# EAGLE design tracksoar programmer (EAGLE 7.3.0)
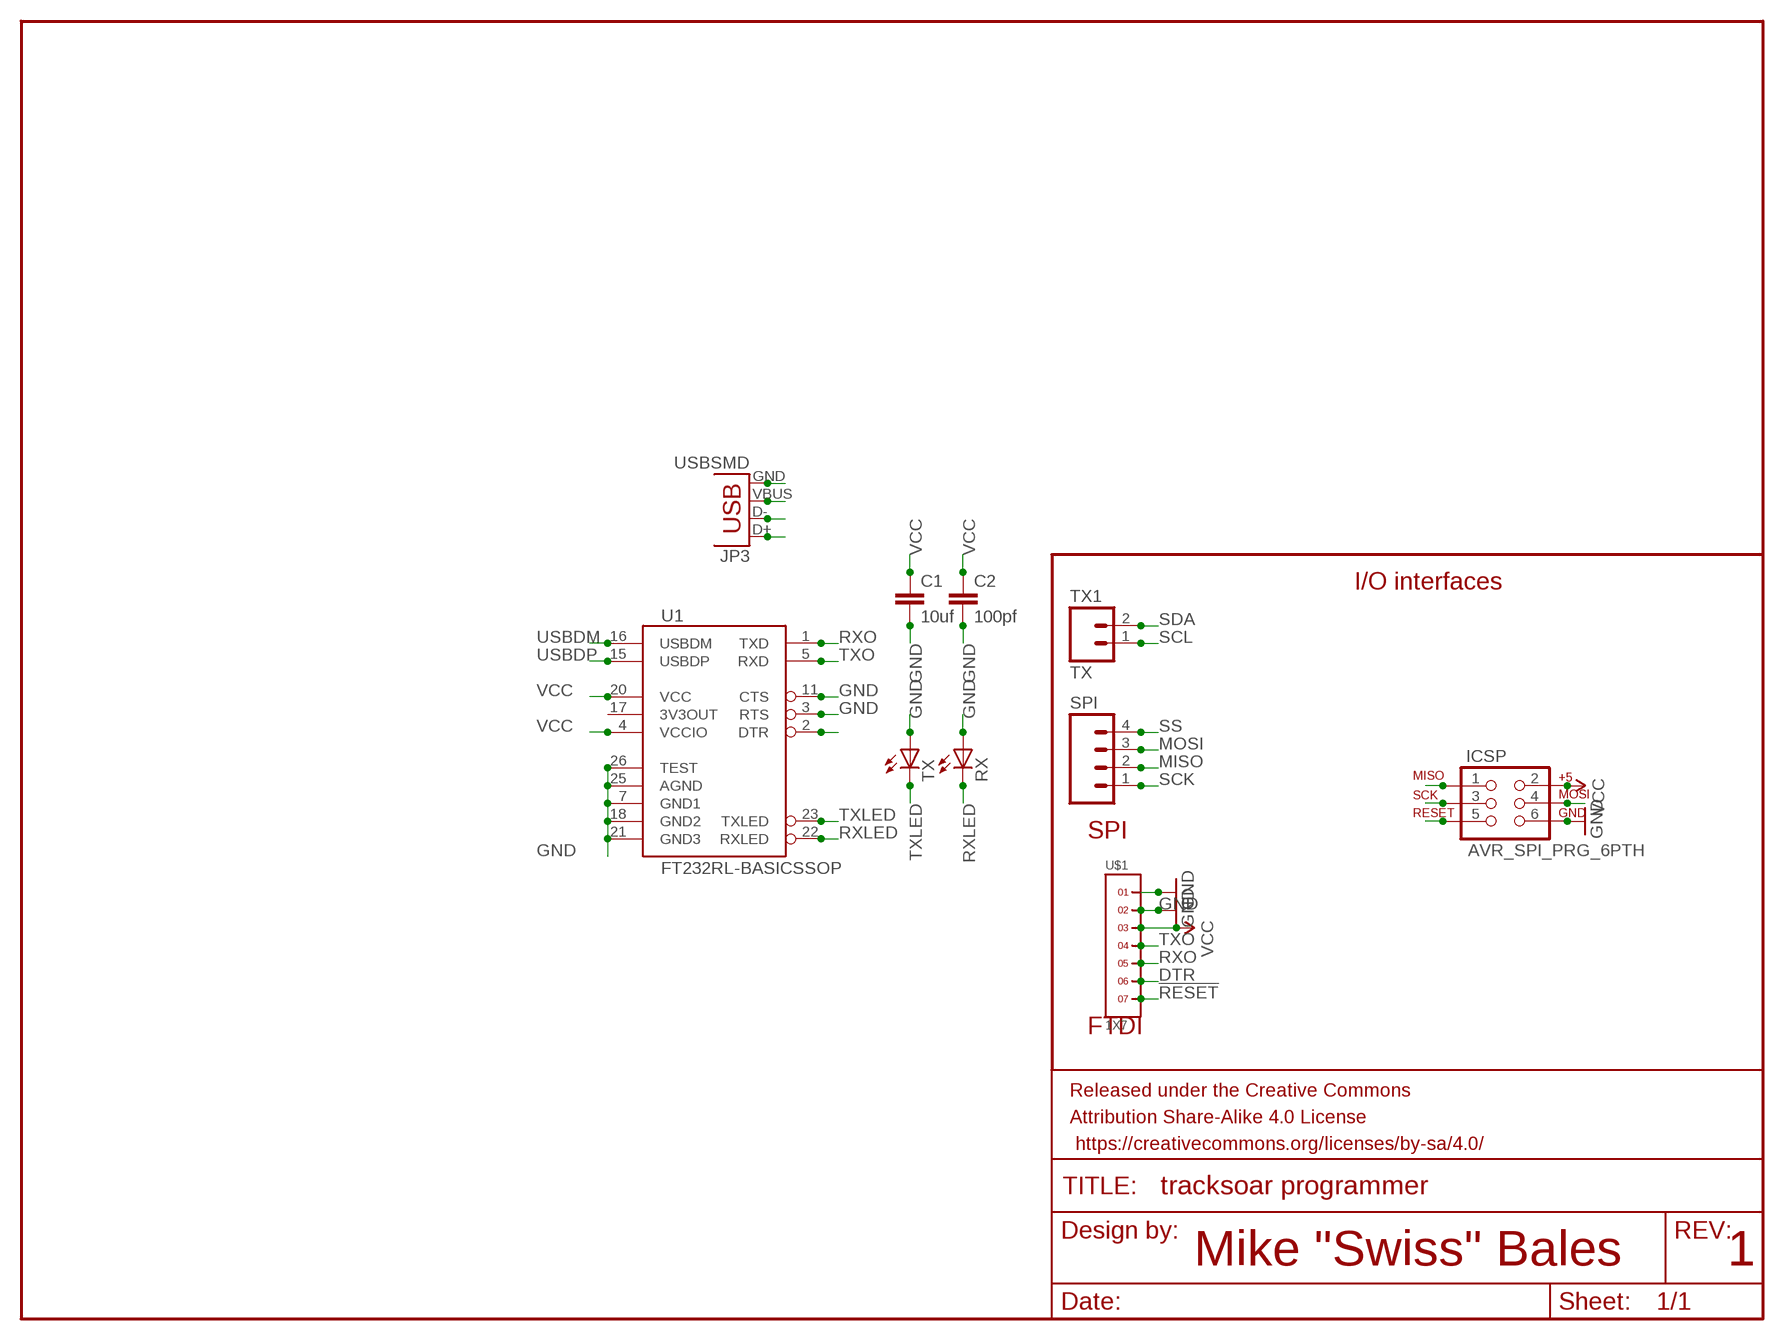
[diagram p0: schematic, sheet 1]

## Parts
C1  10uf  CAP0805  [0805]
C2  100pf  CAP0805  [0805]
FRAME1  FRAME-LETTER  [CREATIVE_COMMONS]
ICSP  AVR_SPI_PRG_6PTH  [2X3]
JP3  USBSMD  [USB-MINIB]
RX  LEDCHIP-LED0805  [CHIP-LED0805]
SPI  M04JST-PTH-VERT  [JST-4-PTH-VERT]
TX  LEDCHIP-LED0805  [CHIP-LED0805]
TX1  TX  M02JST-PTH-VERT  [JST-2-PTH-VERT]
U1  FT232RL-BASICSSOP  [SSOP28DB]
U$1  1X7  [1X7]

## Nets
!RESET: ICSP.5 U$1.7
DTR: U1.2(DTR) U$1.6
GND: C1.2 C2.2 ICSP.6 JP3.GND RX.A TX.A U1.3(RTS) U1.7(GND1) U1.11(CTS) U1.18(GND2) U1.21(GND3) U1.25(AGND) U1.26(TEST) U$1.1 U$1.2
MISO: ICSP.1 SPI.2
MOSI: ICSP.4 SPI.3
RXLED: RX.C U1.22(RXLED)
RXO: U1.1(TXD) U$1.5
SCK: ICSP.3 SPI.1
SCL: TX1.1
SDA: TX1.2
SS: SPI.4
TXLED: TX.C U1.23(TXLED)
TXO: U1.5(RXD) U$1.4
USBDM: JP3.D- U1.16(USBDM)
USBDP: JP3.D+ U1.15(USBDP)
VCC: C1.1 C2.1 ICSP.2 JP3.VBUS U1.4(VCCIO) U1.20(VCC) U$1.3
Unconnected: U1.17(3V3OUT)

## Notes on the sheet
- I/O interfaces
- SPI
- FTDI
- Mike "Swiss" Bales | 1

## Library data of the parts
C1 C2 = SparkFun-Passives:CAP: Capacitor Standard 0603 ceramic capacitor, and 0.1" leaded capacitor.
FRAME1 = SparkFun-Aesthetics:FRAME-LETTER: Schematic Frame Standard 8.5x11 US Letter frame
ICSP = SparkFun-Connectors:AVR_SPI_PRG_6: AVR ISP 6 Pin This is the reduced ISP connector for AVR programming. Common on Arduino. This footprint will take up less PCB space and can be used with a 10-pin to 6-pin adapter such as SKU: BOB-08508 **Special note about "TEST_POINT" package. The stop mask is on the top side, so if you want your programming test points to be on the bottom of your board, make sure to place this package on the bottom side of the board. This also ensure that the orientation to program from the bottom side will be correct.
JP3 = SparkFun-Connectors:USB: USB Connectors USB-B-PTH is fully proven SKU : PRT-00139/CONN-08278 USB-miniB is fully proven SKU : PRT-00587 USB-A-PCB is untested. USB-A-H is throughly reviewed, but untested. Spark Fun Electronics SKU : PRT-00437 USB-B-SMT is throughly reviewed, but untested. Needs silkscreen touching up. USB-A-S has not been used/tested USB-MB-H has not been used/tested USB-MICROB has been used. CONN-09505; PROD_ID: CONN-08193
RX TX = adafruit:LED: LED OSRAM: - CHIPLED LG R971, LG N971, LY N971, LG Q971, LY Q971, LO R971, LY R971 LH N974, LH R974 LS Q976, LO Q976, LY Q976 LO Q996 - Hyper CHIPLED LW Q18S LB Q993, LB Q99A, LB R99A - SideLED LS A670, LO A670, LY A670, LG A670, LP A670 LB A673, LV A673, LT A673, LW A673 LH A674 LY A675 LS A676, LA A676, LO A676, LY A676, LW A676 LS A679, LY A679, LG A679 - Hyper Micro SIDELED® LS Y876, LA Y876, LO Y876, LY Y876 LT Y87S - SmartLED LW L88C, LW L88S LB L89C, LB L89S, LG L890 LS L89K, LO L89K, LY L89K LS L896, LA L896, LO L896, LY L896 - TOPLED LS T670, LO T670, LY T670, LG T670, LP T670 LSG T670, LSP T670, LSY T670, LOP T670, LYG T670 LG T671, LOG T671, LSG T671 LB T673, LV T673, LT T673, LW T673 LH T674 LS T676, LA T676, LO T676, LY T676, LB T676, LH T676, LSB T676, LW T676 LB T67C, LV T67C, LT T67C, LS T67K, LO T67K, LY T67K, LW E67C LS E67B, LA E67B, LO E67B, LY E67B, LB E67C, LV E67C, LT E67C LW T67C LS T679, LY T679, LG T679 LS T770, LO T770, LY T770, LG T770, LP T770 LB T773, LV T773, LT T773, LW T773 LH T774 LS E675, LA E675, LY E675, LS T675 LS T776, LA T776, LO T776, LY T776, LB T776 LHGB T686 LT T68C, LB T68C - Hyper Mini TOPLED® LB M676 - Mini TOPLED Santana® LG M470 LS M47K, LO M47K, LY M47K Source: http://www.osram.convergy.de/
SPI = SparkFun-Connectors:M04: Header 4 Standard 4-pin 0.1" header. Use with straight break away headers (SKU : PRT-00116), right angle break away headers (PRT-00553), swiss pins (PRT-00743), machine pins (PRT-00117), and female headers (PRT-00115). Molex polarized connector foot print use with SKU : PRT-08231 with associated crimp pins and housings. 1MM SMD Version SKU: PRT-10208
TX1 = SparkFun-Connectors:M02: Standard 2-pin 0.1" header. Use with - straight break away headers ( PRT-00116) - right angle break away headers (PRT-00553) - swiss pins (PRT-00743) - machine pins (PRT-00117) - female headers (PRT-00115) Molex polarized connector foot print use with: PRT-08233 with associated crimp pins and housings. 2.54_SCREWTERM for use with PRT-10571. 3.5mm Screw Terminal footprints for PRT-08084 5mm Screw Terminal footprints for use with PRT-08432
U1 = SparkFun-DigitalIC:FT232RL-BASIC: USB UART This is the simplified version of the FT232RL unit. Only what you need, nothing you don't. Spark Fun Electronics SKU : COM-00650
U$1 = headers(2mm):1X7

## Board
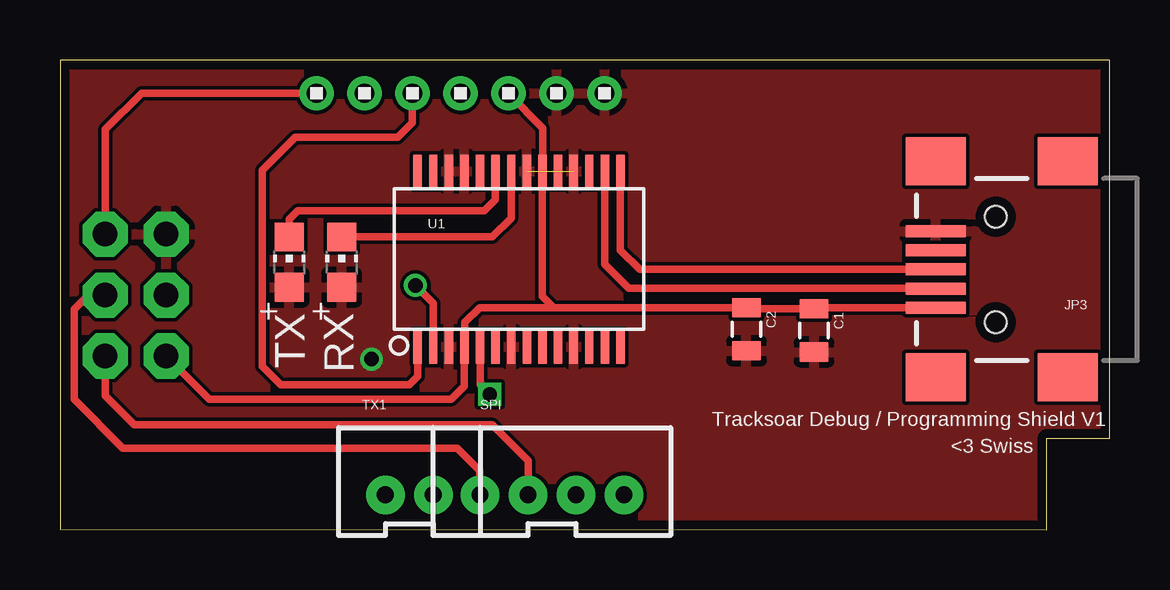
[diagram p1: board, top side]
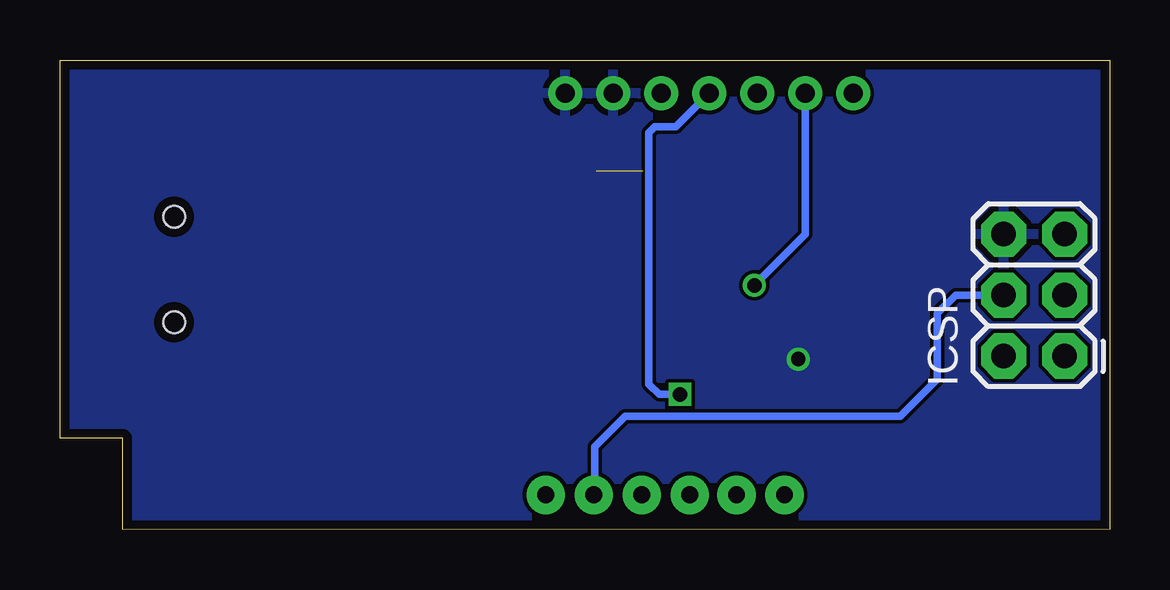
[diagram p2: board, bottom side, seen from below]

Size 43.74 x 19.57 mm. Coordinates in mm from the lower left corner, seen from the top.
Outline: 41.12,0 0,0.03 0,19.57 43.74,19.57 43.74,3.81 41.12,3.81 41.12,0.03
Copper layers (1*16): Top 0.0356mm / dielectric 1.5011mm / Bottom 0.0356mm
Design rules "oshpark-2layer": minimum track width 6mil, minimum drill 13mil, track to track 6mil, track to pad 6mil, pad to pad 6mil, via to via 6mil, smd to smd 6mil, copper to edge 15mil, drill to drill 6mil, minimum pad ring 7mil, minimum via ring 7mil, stop-mask expansion 4mil, vias tented up to drill 0mil, thermal gap 10mil

### Footprints (pad centres in the part's own frame; a part is rotated, then mirrored left to right if it is on the bottom)
0805 = smd 0.8 x 1.2: 1 -0.9,0; 2 0.9,0
2X3 = drill 1.016 pad 1.88 octagon: 1 0,0; 2 0,2.54; 3 2.54,0; 4 2.54,2.54; 5 5.08,0; 6 5.08,2.54
USB-MINIB = smd 2.5 x 0.5: D+ 2.5,0; D- 2.5,0.8; GND 2.5,-1.6; ID 2.5,-0.8; VBUS 2.5,1.6 | smd 2.5 x 2: MTN1 -3,4.5; MTN2 2.5,4.5; MTN3 -3,-4.5; MTN4 2.5,-4.5 | hole 0.9: 0,2.2; 0,-2.2
CHIP-LED0805 = smd 1.2 x 1.2: A 0,-1.05; C 0,1.05
JST-4-PTH-VERT = drill 0.7 pad 1.6: 1 -3,-0.55; 2 -1,-0.55; 3 1,-0.55; 4 3,-0.55
JST-2-PTH-VERT = drill 0.7 pad 1.6: 1 -1,-0.55; 2 1,-0.55
SSOP28DB = smd 0.348 x 1.397: 1 -4.225,-3.656; 2 -3.575,-3.656; 3 -2.925,-3.656; 4 -2.275,-3.656; 5 -1.625,-3.656; 6 -0.975,-3.656; 7 -0.325,-3.656; 8 0.325,-3.656; 9 0.975,-3.656; 10 1.625,-3.656; 11 2.275,-3.656; 12 2.925,-3.656; 13 3.575,-3.656; 14 4.225,-3.656; 15 4.225,3.656; 16 3.575,3.656; 17 2.925,3.656; 18 2.275,3.656; 19 1.625,3.656; 20 0.975,3.656; 21 0.325,3.656; 22 -0.325,3.656; 23 -0.975,3.656; 24 -1.625,3.656; 25 -2.275,3.656; 26 -2.925,3.656; 27 -3.575,3.656; 28 -4.225,3.656
1X7 = drill 0.8 pad 1.422: 1 -6,0; 2 -4,0; 3 -2,0; 4 0,0; 5 2,0; 6 4,0; 7 6,0

### Placement (x,y rotation side)
C1  31.42,8.31 270 top
C2  28.6,8.36 270 top
FRAME1  14.78,-7.8 0 top  (outside the outline)
ICSP  1.88,7.24 90 bottom
JP3  38.99,10.85 180 top
RX  11.73,11.15 0 top
SPI  20.5,2.01 0 top
TX  9.55,11.15 0 top
TX1  14.55,2.01 0 top
U1  19.13,11.28 0 top
U$1  16.69,18.19 180 top

### Tracks (layer width: path | path; a pad name or v marks a point on that pad's centre or on a via)
!RESET
  Top 0.305: ICSP.5 1.88,16.69 3.4,18.19 U$1.7
DTR  (via drill 0.6)
  Top 0.305: U1.2 15.55,9.44 v14.81,10.19
  Bottom 0.305: v14.81,10.19 12.69,12.31 U$1.6
GND  (via drill 0.6)  (1 unrouted)
  other vias: 12.98,7.11
  pour Top: 0,19.58 43.74,19.58 43.74,0 0,0.03 0.05,3.78
  pour Bottom: 0,19.58 43.74,19.58 43.74,0 0,0.03 0.05,3.78
MISO
  Top 0.305: ICSP.1 1.88,5.59 3.1,4.37 18.01,4.37 19.51,2.87 SPI.2
MOSI
  Bottom 0.305: ICSP.4 6.43,9.78 7.19,9.02 7.19,6.27 8.74,4.72 20.19,4.72 21.46,3.45 21.46,1.49 SPI.3
RXLED
  Top 0.305: RX.C 18.02,12.2 18.8,12.98 U1.22
RXO
  Top 0.305: U1.1 14.91,7.61 14.91,6.4 14.55,6.05 9.19,6.05 8.43,6.81 8.43,14.99 9.8,16.36 14.07,16.36 14.68,16.97 U$1.5
SCK
  Top 0.305: SPI.1 17.5,2.47 16.56,3.4 2.62,3.4 0.58,5.44 0.58,9.19 1.17,9.78 ICSP.3
TXLED
  Top 0.305: TX.C 9.55,12.93 9.91,13.28 17.68,13.28 18.14,13.74 18.14,14.85 U1.23
TXO  (via drill 0.6)
  Top 0.305: U1.5 17.5,6.04 v17.91,5.64
  Bottom 0.305: v17.91,5.64 18.77,5.64 19.2,6.07 19.2,16.54 18.95,16.79 18.08,16.79 U$1.4
USBDM
  Top 0.305: U1.16 22.7,11.06 23.7,10.06 36.4,10.06 JP3.D-
USBDP
  Top 0.305: U1.15 23.35,11.65 24.16,10.85 JP3.D+
VCC
  Top 0.305: JP3.VBUS 31.46,9.25 C1.1 28.65,9.21 C2.1 20.57,9.26 | 20.57,9.26 17.49,9.26 16.87,8.64 16.87,7.64 U1.4 16.85,5.98 16.31,5.44 6.22,5.44 ICSP.2 | 20.57,9.26 20.1,9.73 U1.20 20.12,14.95 20.12,16.74 18.69,18.17 U$1.3

### Text on the board
tNames: Tracksoar Debug / Programming Shield V1 | <3 Swiss